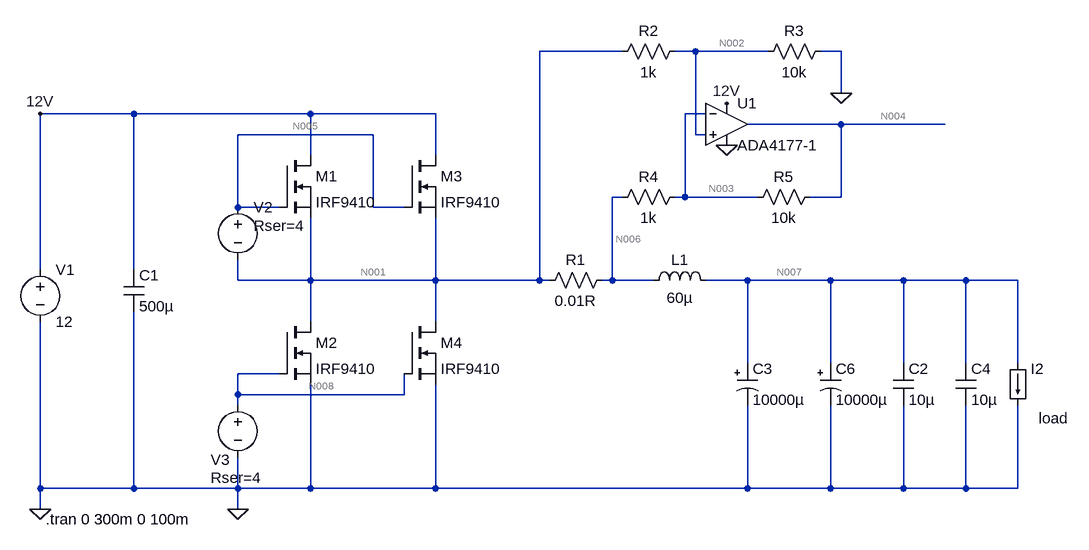
[diagram p0: schematic Sync buck DC-DC.asc]
Sync buck DC-DC.asc, the LTspice schematic file:
Version 4
SHEET 1 1540 680
WIRE 848 -96 720 -96
WIRE 960 -96 928 -96
WIRE 1072 -96 960 -96
WIRE 1184 -96 1152 -96
WIRE 1184 -32 1184 -96
WIRE 96 0 -48 0
WIRE 368 0 96 0
WIRE 560 0 368 0
WIRE 976 0 944 0
WIRE 1184 16 1040 16
WIRE 1344 16 1184 16
WIRE 464 32 256 32
WIRE 960 32 960 -96
WIRE 976 32 960 32
WIRE 368 64 368 0
WIRE 560 64 560 0
WIRE 848 128 832 128
WIRE 944 128 944 0
WIRE 944 128 928 128
WIRE 1056 128 944 128
WIRE 1184 128 1184 16
WIRE 1184 128 1136 128
WIRE 256 144 256 32
WIRE 320 144 256 144
WIRE 464 144 464 32
WIRE 512 144 464 144
WIRE -48 240 -48 0
WIRE 96 240 96 0
WIRE 256 256 256 224
WIRE 368 256 368 160
WIRE 368 256 256 256
WIRE 560 256 560 160
WIRE 560 256 368 256
WIRE 720 256 720 -96
WIRE 720 256 560 256
WIRE 736 256 720 256
WIRE 832 256 832 128
WIRE 832 256 816 256
WIRE 896 256 832 256
WIRE 1040 256 976 256
WIRE 1168 256 1040 256
WIRE 1280 256 1168 256
WIRE 1376 256 1280 256
WIRE 1456 256 1376 256
WIRE 368 320 368 256
WIRE 560 320 560 256
WIRE 1040 384 1040 256
WIRE 1168 384 1168 256
WIRE 1280 384 1280 256
WIRE 1376 384 1376 256
WIRE 1456 384 1456 256
WIRE 320 400 256 400
WIRE 256 432 256 400
WIRE 512 432 512 400
WIRE 512 432 256 432
WIRE 256 448 256 432
WIRE -48 576 -48 320
WIRE 96 576 96 304
WIRE 96 576 -48 576
WIRE 256 576 256 528
WIRE 256 576 96 576
WIRE 368 576 368 416
WIRE 368 576 256 576
WIRE 560 576 560 416
WIRE 560 576 368 576
WIRE 1040 576 1040 448
WIRE 1040 576 560 576
WIRE 1168 576 1168 448
WIRE 1168 576 1040 576
WIRE 1280 576 1280 448
WIRE 1280 576 1168 576
WIRE 1376 576 1376 448
WIRE 1376 576 1280 576
WIRE 1456 576 1456 448
WIRE 1456 576 1376 576
WIRE -48 608 -48 576
WIRE 256 608 256 576
FLAG 256 608 0
FLAG -48 0 12V
FLAG 1008 -16 12V
FLAG 1008 48 0
FLAG -48 608 0
FLAG 1184 -32 0
SYMBOL voltage -48 224 R0
WINDOW 123 0 0 Left 2
WINDOW 39 0 0 Left 2
SYMATTR InstName V1
SYMATTR Value 12
SYMBOL voltage 256 128 R0
WINDOW 123 0 0 Left 2
WINDOW 39 24 44 Left 2
WINDOW 3 -157 243 Invisible 2
SYMATTR SpiceLine Rser=4
SYMATTR Value PULSE(0 12 2u 0 0 10u 20u)
SYMATTR InstName V2
SYMBOL ind 880 272 R270
WINDOW 0 32 56 VTop 2
WINDOW 3 5 56 VBottom 2
SYMATTR InstName L1
SYMATTR Value 60µ
SYMATTR SpiceLine Rser=1m
SYMBOL cap 80 240 R0
SYMATTR InstName C1
SYMATTR Value 500µ
SYMBOL nmos 320 64 R0
SYMATTR InstName M1
SYMATTR Value IRF9410
SYMBOL nmos 320 320 R0
SYMATTR InstName M2
SYMATTR Value IRF9410
SYMBOL voltage 256 432 R0
WINDOW 123 0 0 Left 2
WINDOW 39 -42 128 Left 2
WINDOW 0 -42 100 Left 2
WINDOW 3 28 145 Invisible 2
SYMATTR SpiceLine Rser=4
SYMATTR InstName V3
SYMATTR Value PULSE(12 0 0 0 0 14u 20u)
SYMBOL load 1440 384 R0
WINDOW 123 0 0 Left 2
WINDOW 39 48 84 Left 2
WINDOW 3 48 56 Invisible 2
SYMATTR SpiceLine load
SYMATTR Value PULSE(100m 30 10m 0 0 5m 10m)
SYMATTR InstName I2
SYMBOL polcap 1024 384 R0
SYMATTR InstName C3
SYMATTR Value 10000µ
SYMATTR SpiceLine V=10 Irms=1.98 Rser=0.038 Lser=0 mfg="Nichicon" pn="UPR1A103MRH" type="Al electrolytic"
SYMBOL cap 1264 384 R0
SYMATTR InstName C2
SYMATTR Value 10µ
SYMATTR SpiceLine V=25 Irms=0 Rser=0.001 Lser=0 mfg="TDK" pn="C575OX7RIE106M" type="X7R"
SYMBOL cap 1360 384 R0
SYMATTR InstName C4
SYMATTR Value 10µ
SYMATTR SpiceLine V=25 Irms=0 Rser=0.001 Lser=0 mfg="TDK" pn="C575OX7RIE106M" type="X7R"
SYMBOL polcap 1152 384 R0
SYMATTR InstName C6
SYMATTR Value 10000µ
SYMATTR SpiceLine V=10 Irms=1.98 Rser=0.038 Lser=0 mfg="Nichicon" pn="UPR1A103MRH" type="Al electrolytic"
SYMBOL nmos 512 64 R0
SYMATTR InstName M3
SYMATTR Value IRF9410
SYMBOL nmos 512 320 R0
SYMATTR InstName M4
SYMATTR Value IRF9410
SYMBOL res 832 240 R90
WINDOW 0 0 56 VBottom 2
WINDOW 3 32 56 VTop 2
SYMATTR InstName R1
SYMATTR Value 0.01R
SYMBOL Opamps\\ADA4177-1 1008 16 R0
SYMATTR InstName U1
SYMBOL res 944 -112 R90
WINDOW 0 0 56 VBottom 2
WINDOW 3 32 56 VTop 2
SYMATTR InstName R2
SYMATTR Value 1k
SYMBOL res 1168 -112 R90
WINDOW 0 0 56 VBottom 2
WINDOW 3 32 56 VTop 2
SYMATTR InstName R3
SYMATTR Value 10k
SYMBOL res 944 112 R90
WINDOW 0 0 56 VBottom 2
WINDOW 3 32 56 VTop 2
SYMATTR InstName R4
SYMATTR Value 1k
SYMBOL res 1152 112 R90
WINDOW 0 0 56 VBottom 2
WINDOW 3 32 56 VTop 2
SYMATTR InstName R5
SYMATTR Value 10k
TEXT -40 624 Left 2 !.tran 0 300m 0 100m

The netlist it stands for:
* Sync buck DC-DC.asc
V1 12V 0 12
V2 N005 N001 PULSE(0 12 2u 0 0 10u 20u) Rser=4
L1 N006 N007 60µ Rser=1m
C1 12V 0 500µ
M1 12V N005 N001 N001 IRF9410
M2 N001 N008 0 0 IRF9410
V3 N008 0 PULSE(12 0 0 0 0 14u 20u) Rser=4
I2 N007 0 PULSE(100m 30 10m 0 0 5m 10m) load
C3 N007 0 10000µ V=10 Irms=1.98 Rser=0.038 Lser=0 mfg="Nichicon" pn="UPR1A103MRH" type="Al electrolytic"
C2 N007 0 10µ V=25 Irms=0 Rser=0.001 Lser=0 mfg="TDK" pn="C575OX7RIE106M" type="X7R"
C4 N007 0 10µ V=25 Irms=0 Rser=0.001 Lser=0 mfg="TDK" pn="C575OX7RIE106M" type="X7R"
C6 N007 0 10000µ V=10 Irms=1.98 Rser=0.038 Lser=0 mfg="Nichicon" pn="UPR1A103MRH" type="Al electrolytic"
M3 12V N005 N001 N001 IRF9410
M4 N001 N008 0 0 IRF9410
R1 N006 N001 0.01R
* U1: ADA4177-1 (symbol Opamps\ADA4177-1 not available, pins judged from their places): In+=N002 In-=N003 V+=12V V-=0 OUT=N004
R2 N002 N001 1k
R3 0 N002 10k
R4 N003 N006 1k
R5 N004 N003 10k
.model NMOS NMOS
.model PMOS PMOS
.lib standard.mos
.tran 0 300m 0 100m
.backanno
.end

* Results of the author's LTspice run, read from the files saved beside the schematic
* Operating Point, zero values left out:
*   V(12v) = 12 V
*   V(n005) = 25.84 nV
*   V(n001) = 25.84 nV
*   V(n006) = 48.29 nV
*   V(n007) = 48.28 nV
*   V(n008) = 12 V
*   V(n003) = 2.265 mV
*   V(n002) = 901.7 nV
*   V(n004) = 24.92 mV
*   Id(M4) = 1.123 µA
*   Is(M4) = -1.123 µA
*   Id(M3) = 47.96 pA
*   Is(M3) = -47.96 pA
*   Id(M2) = 1.123 µA
*   Is(M2) = -1.123 µA
*   Id(M1) = 47.96 pA
*   Is(M1) = -47.96 pA
*   I(L1) = 19.31 nA
*   I(I2) = 19.31 nA
*   I(R5) = 2.265 µA
*   I(R4) = 2.265 µA
*   I(R3) = -90.17 pA
*   I(R2) = 875.9 pA
*   I(R1) = 2.246 µA
*   I(V1) = -489.6 µA
*   Ix(u1:1) = -966.1 pA
*   Ix(u1:2) = 106 pA
*   Ix(u1:3) = 489.6 µA
*   Ix(u1:4) = -474.5 µA
*   Ix(u1:5) = -2.265 µA